# EAGLE schematic RAFT_DuckLink_LDO_3V3 (EAGLE 9.5.2)
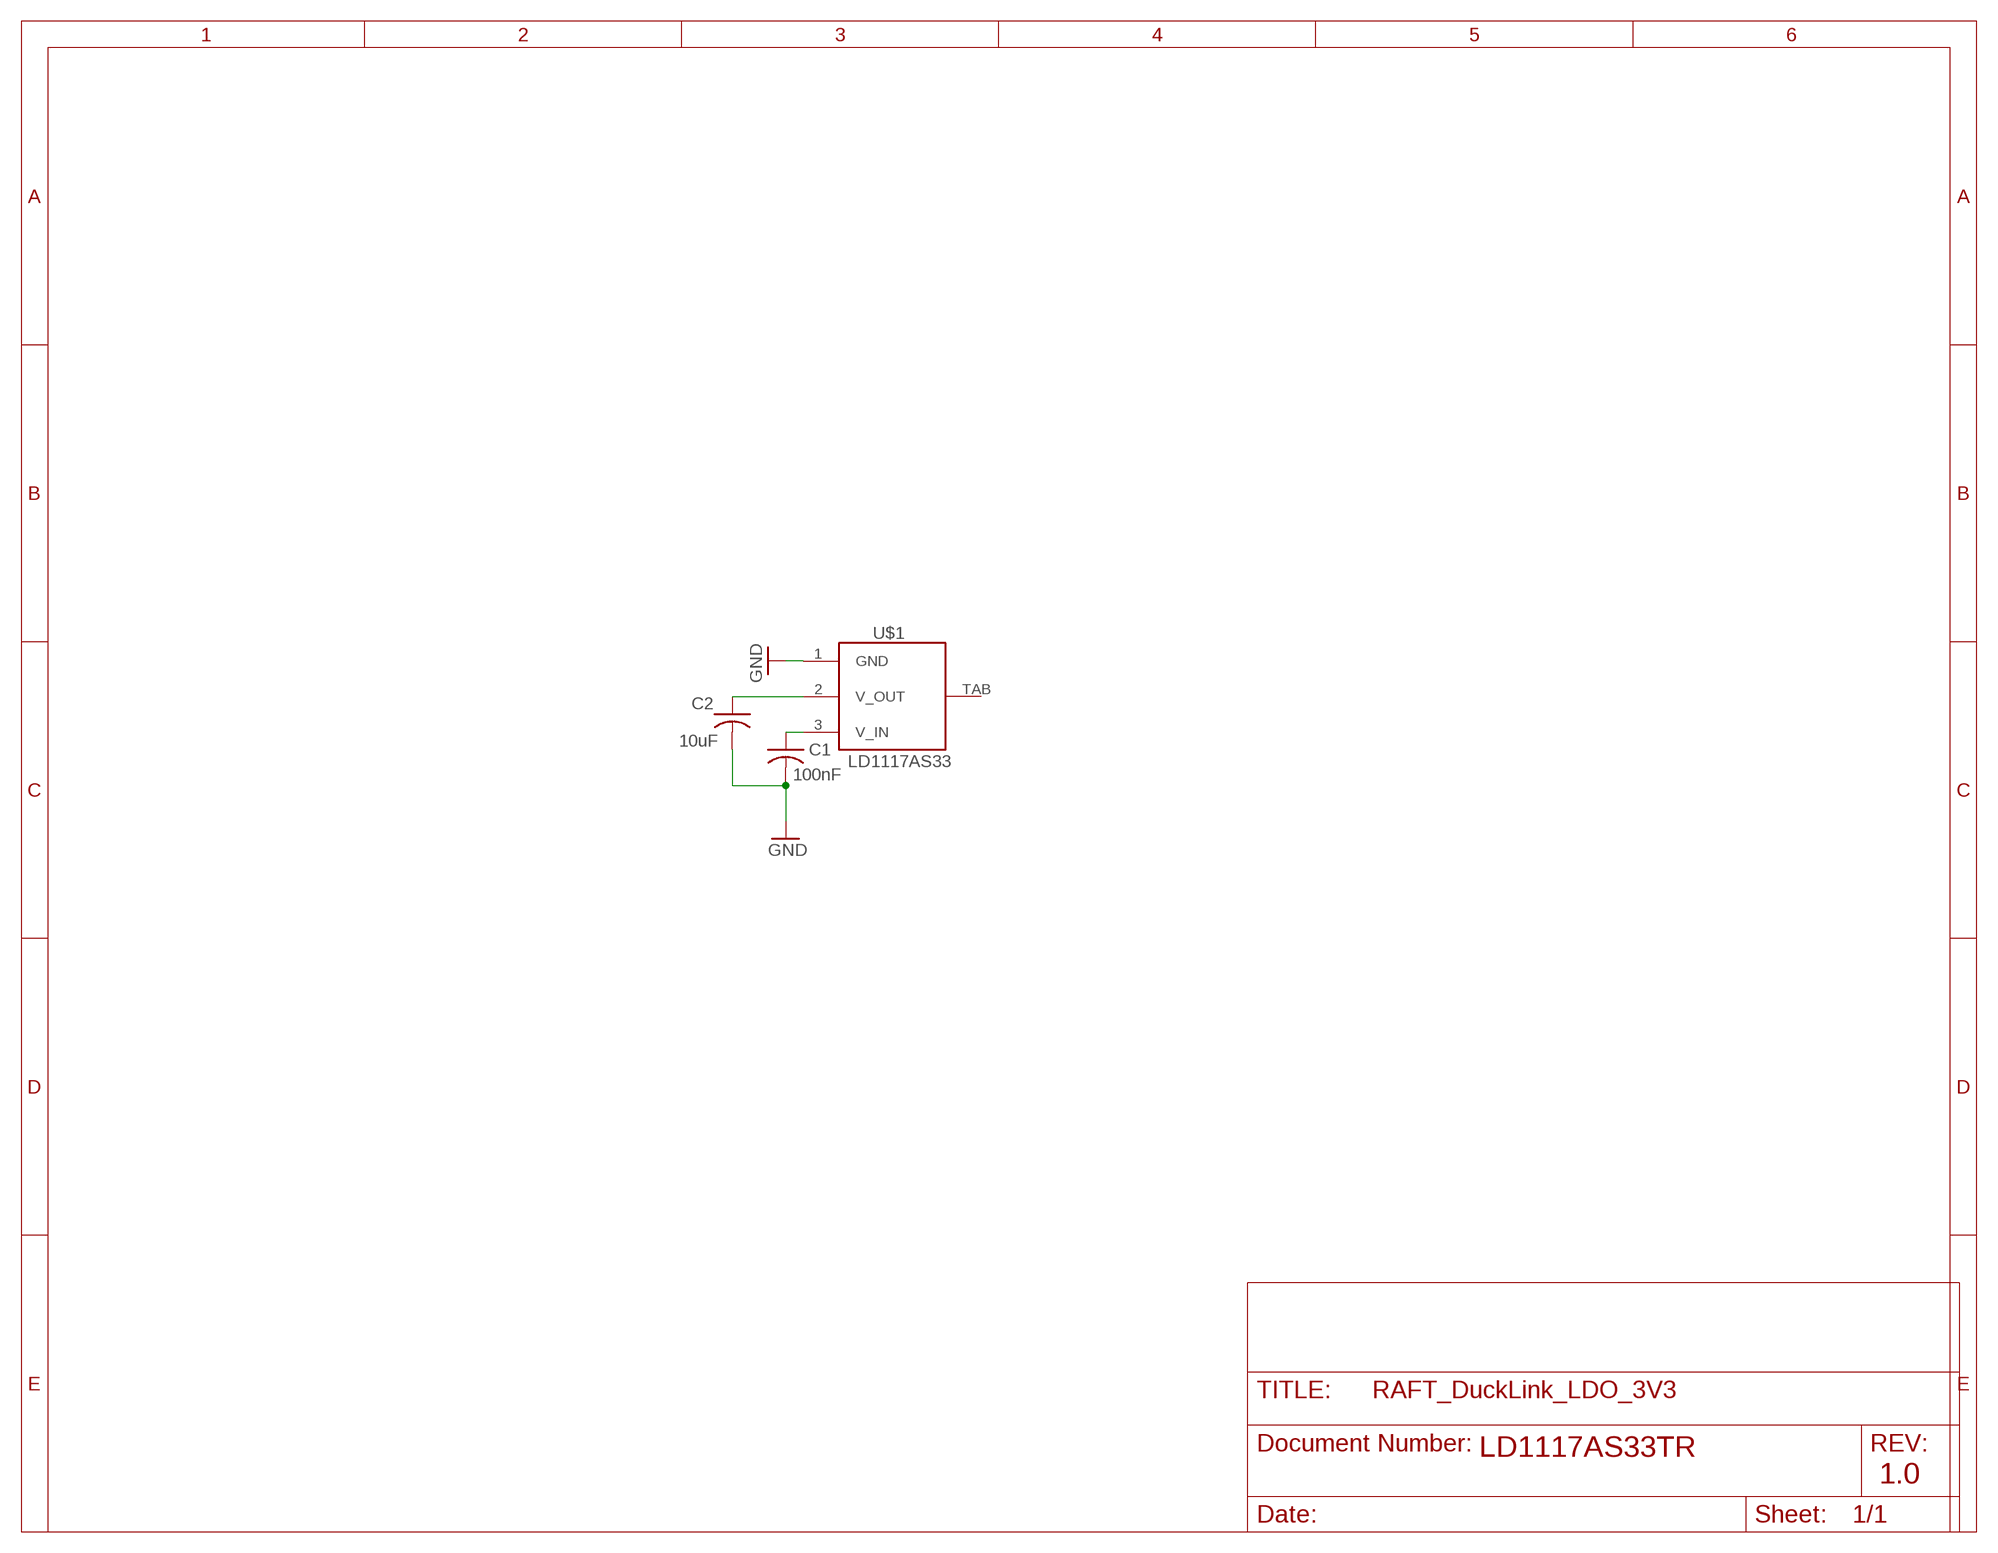
[diagram p0: schematic, sheet 1]

## Parts
C1  100nF  C-USC0402  [C0402]
C2  10uF  C-USC0402  [C0402]
U$1  LD1117AS33  [SOT223]

## Nets
GND: C1.2 C2.2 U$1.1(GND)
N$1: C1.1 U$1.3(V_IN)
N$2: C2.1 U$1.2(V_OUT)
Unconnected: U$1.TAB

## Notes on the sheet
- LD1117AS33TR
- 1.0

## Library data of the parts
C1 C2 = rcl:C-US: CAPACITOR, American symbol; SPICEPREFIX: C
U$1 = LD1117AS33:LD1117AS33; AVAILABILITY: Unavailable; DESCRIPTION: Linear Voltage Regulator IC 1 Output 1A SOT-223; MF: STMicroelectronics; MP: LD1117AS33; PACKAGE: SOT-223 STMicroelectronics; PRICE: None